# EAGLE design cm3 (EAGLE 7.7.0)
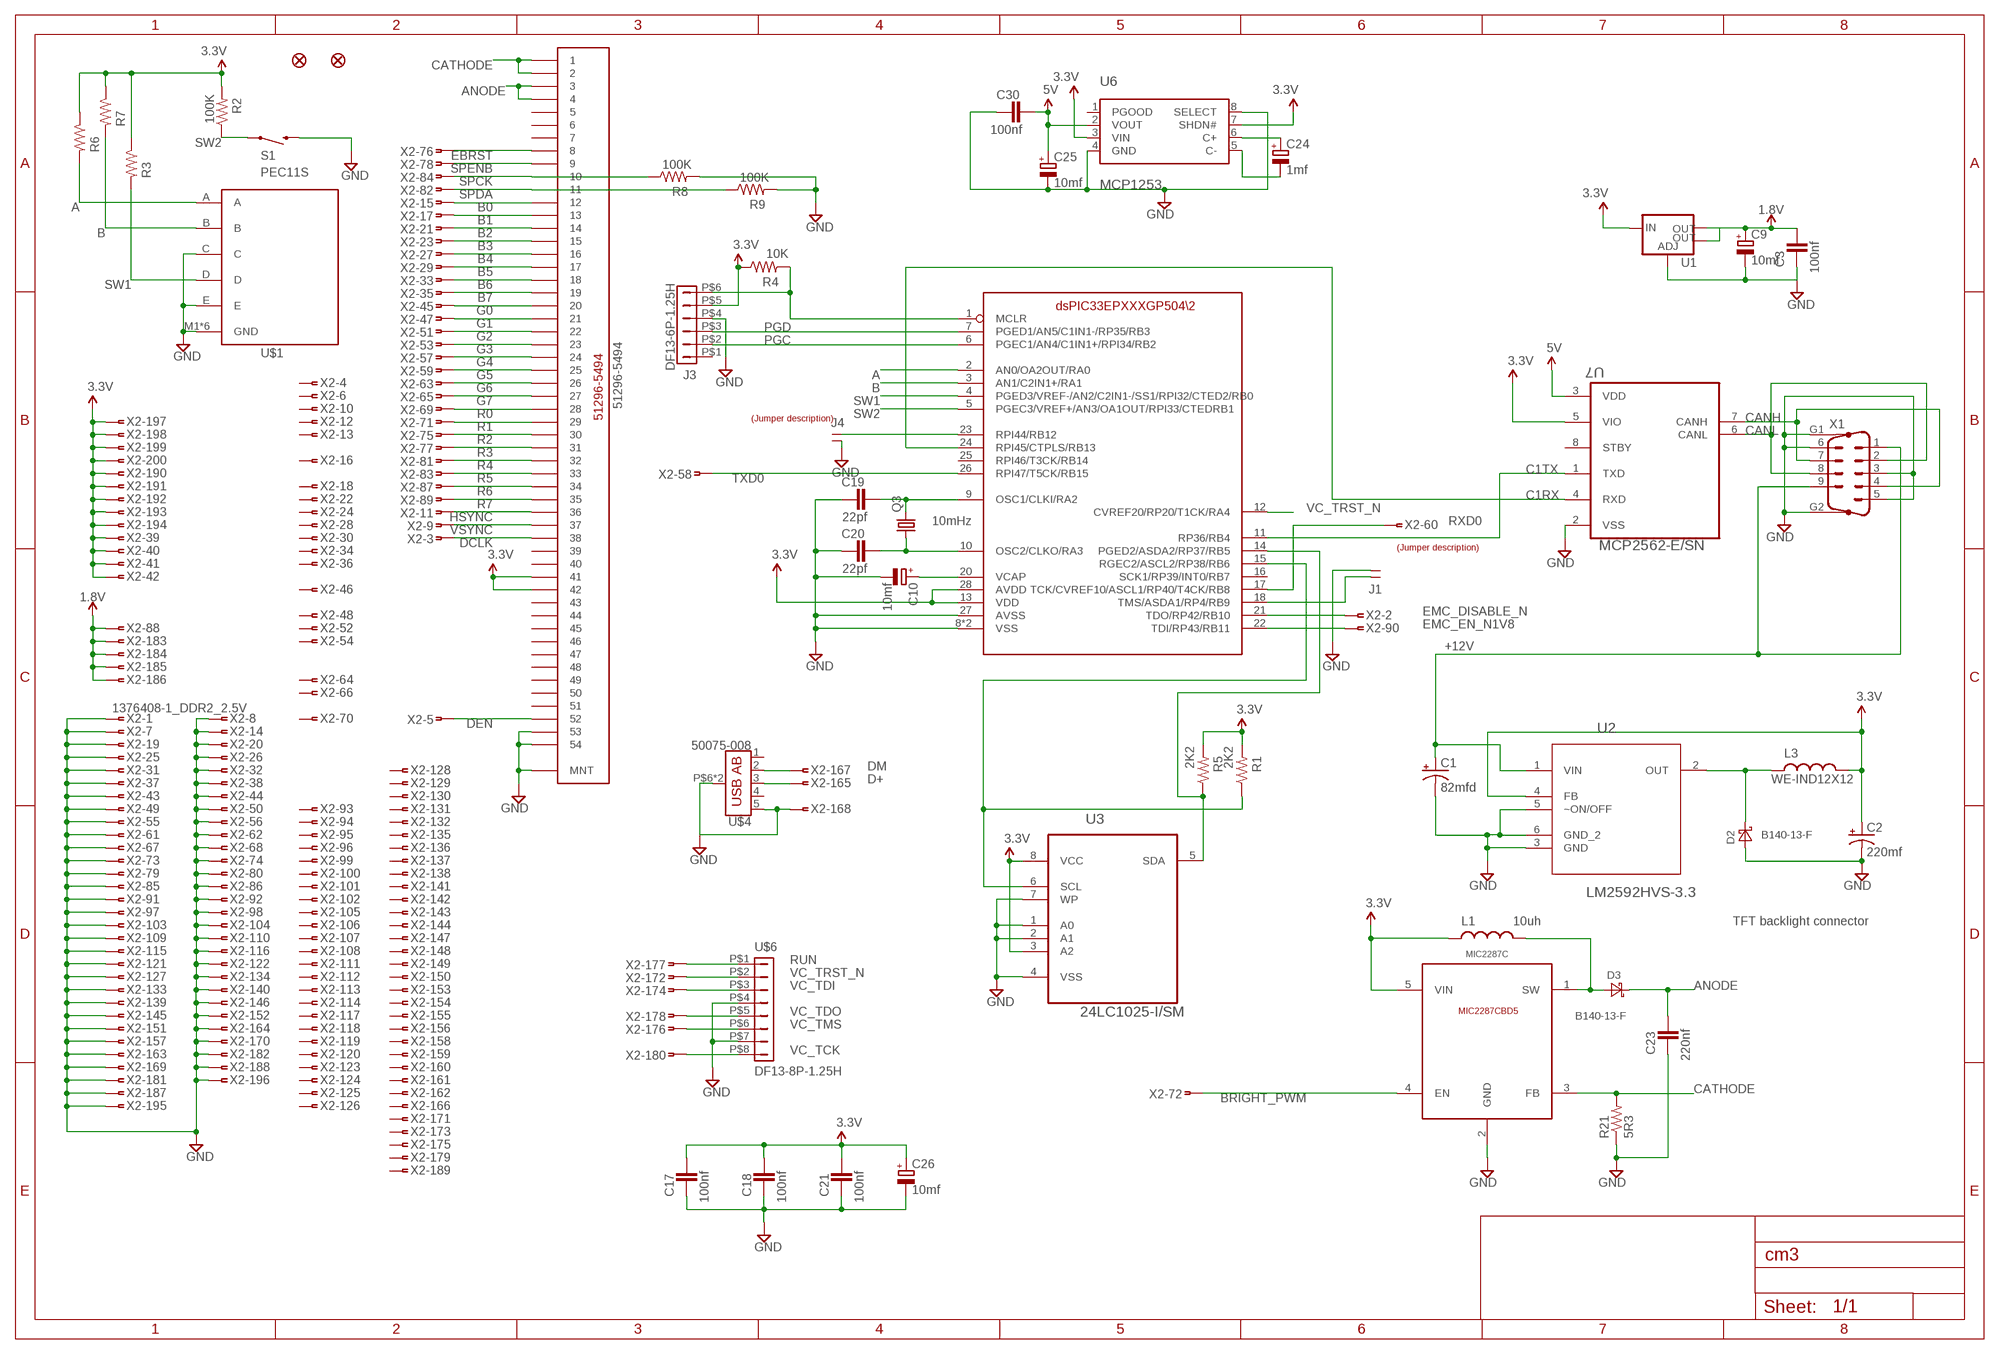
[diagram p0: schematic, sheet 1]

## Parts
C1  82mfd  CAPACITOR_POL-SVPF-E7  [SVPF-E7]
C2  220mf  CAP_POL7343  [EIA7343]
C3  100nf  CAPACITOR_NPOL-0805  [C805]
C9  10mf  CAPACITOR_POL-SMC_A  [SMC_A]
C10  10mf  CAPACITOR_POL-SMC_A  [SMC_A]
C17  100nf  CAPACITOR_NPOL-0805  [C805]
C18  100nf  CAPACITOR_NPOL-0805  [C805]
C19  22pf  CAPACITOR_NPOL-0805  [C805]
C20  22pf  CAPACITOR_NPOL-0805  [C805]
C21  100nf  CAPACITOR_NPOL-0805  [C805]
C23  220nf  CAPACITOR_NPOL-0805  [C805]
C24  1mf  CAPACITOR_POL-SMC_A  [SMC_A]
C25  10mf  CAPACITOR_POL-SMC_A  [SMC_A]
C26  10mf  CAPACITOR_POL-SMC_A  [SMC_A]
C30  100nf  CAPACITOR_NPOL-0805  [C805]
D2  B140-13-F  DIODE-SCHOTTKY-SMA  [SMA]
D3  B140-13-F  DIODE-SCHOTTKY-SMA  [SMA]
J1  JUMPER-1X2  [JUMPER-1X2]
J3  DF13-6P-1.25H  [DF13A-6P-1.25H]
J4  JUMPER-1X2  [JUMPER-1X2]
JP1  FIDUCIAL1.5X3  [FIDUCIAL-1.5X3]
JP2  FIDUCIAL1.5X3  [FIDUCIAL-1.5X3]
L1  10uh  INDUCTOR  [1812]
L3  WE-IND12X12  [IND12X12]
Q3  10mHz  CRYSTALHC49S  [HC49/S]
R1  2K2  RESISTOR0603-RES  [0603-RES]
R2  100K  RESISTOR0603-RES  [0603-RES]
R3  10K  RESISTOR0603-RES  [0603-RES]
R4  10K  RESISTOR0603-RES  [0603-RES]
R5  2K2  RESISTOR0603-RES  [0603-RES]
R6  10K  RESISTOR0603-RES  [0603-RES]
R7  10K  RESISTOR0603-RES  [0603-RES]
R8  100K  RESISTOR0603-RES  [0603-RES]
R9  100K  RESISTOR0603-RES  [0603-RES]
R21  5R3  RESISTOR1812-RES  [1812]
S1  SWITCH-MOMENTARY-2SMD-4  [TACTILE_SWITCH_TALL]
U1  V_REG_LM1117SOT223  [SOT223]
U2  LM2592HVS-3.3  LM2592HVS-5.0  [TO170P1435X457-5N]
U3  24LC1025-I/SM  [SOIC8-N_MC]
U5  DSPIC33EPXXXGP502  [SOIC-28]
U6  MCP1253  [MSOP8]
U7  MCP2562-E/SN  [SOIC-8N]
U9  MIC2287C  [SOT-23-5]
U$1  PEC11S  [PEC11S]
U$2  51296-5494  [51296-5494]
U$3  LABEL_JUMPER_1X2  [JUMP2_DESC]
U$4  50075-008  [500075-008]
U$5  LABEL_JUMPER_1X2  [JUMP2_DESC]
U$6  DF13-8P-1.25H  [DF13A-8P-1.25H]
X1  M09VP  [M09VP]
X2  1376408-1_DDR2_2.5V  [6-1376408-1]

## Nets
1.8V: C3.1 C9.+ U1.2(OUT) U1.4(OUT) X2.88 X2.183 X2.184 X2.185 X2.186
3.3V: C2.A(+) C17.1 C18.1 C21.1 C26.+ J3.P$5 L1.1 L3.P$2 R1.2 R2.2 R3.1 R4.1 R5.2 R6.1 R7.1 U1.3(IN) U2.4(FB) U3.3(A2) U3.8(VCC) U5.13(VDD) U5.28(AVDD) U6.3(VIN) U6.7(SHDN#) U7.5(VIO) U9.5(VIN) U$2.P$41 U$2.P$42 X2.39 X2.40 X2.41 X2.42 X2.190 X2.191 X2.192 X2.193 X2.194 X2.197 X2.198 X2.199 X2.200
5V: C25.+ C30.1 U6.2(VOUT) U7.3(VDD)
!MCLR: J3.P$6 R4.2 U5.1(MCLR)
+12V: C1.P$2(+) U2.1(VIN) X1.1 X1.9
A: R6.2 U5.2(AN0/OA2OUT/RA0) U$1.A
ANODE: C23.1 D3.C U$2.P$3 U$2.P$4
B: R7.2 U5.3(AN1/C2IN1+/RA1) U$1.B
B0: U$2.P$12 X2.15
B1: U$2.P$13 X2.17
B2: U$2.P$14 X2.21
B3: U$2.P$15 X2.23
B4: U$2.P$16 X2.27
B5: U$2.P$17 X2.29
B6: U$2.P$18 X2.33
B7: U$2.P$19 X2.35
BRIGHT_PWM: U9.4(EN) X2.72
C1RX: U5.24(RPI45/CTPLS/RB13) U7.4(RXD)
C1TX: U5.11(RP36/RB4) U7.1(TXD)
CANH: U7.7(CANH) X1.4 X1.7
CANL: U7.6(CANL) X1.2 X1.8
CATHODE: R21.2 U9.3(FB) U$2.P$1 U$2.P$2
D+: U$4.3(D+) X2.165
DCLK: U$2.P$38 X2.3
DEN: U$2.P$52 X2.5
DM: U$4.2(D-) X2.167
EBRST: U$2.P$8 X2.76
EMC_DISABLE_N: U5.21(TDO/RP42/RB10) X2.2
EMC_EN_N1V8: U5.22(TDI/RP43/RB11) X2.90
G0: U$2.P$20 X2.45
G1: U$2.P$21 X2.47
G2: U$2.P$22 X2.51
G3: U$2.P$23 X2.53
G4: U$2.P$24 X2.57
G5: U$2.P$25 X2.59
G6: U$2.P$26 X2.63
G7: U$2.P$27 X2.65
GND: C1.P$1(-) C2.C(-) C3.2 C9.- C10.- C17.2 C18.2 C19.2 C20.2 C21.2 C23.2 C25.- C26.- C30.2 D2.A J1.2 J3.P$4 J4.2 R8.2 R9.2 R21.1 S1.B2 U1.1(ADJ) U2.3(GND) U2.5(~ON/OFF) U2.6(GND_2) U3.1(A0) U3.2(A1) U3.4(VSS) U3.7(WP) U5.8(VSS) U5.19(VSS) U5.27(AVSS) U6.4(GND) U6.8(SELECT) U7.2(VSS) U9.2(GND) U$1.C U$1.E U$1.M1(GND) U$1.M2(GND) U$1.M3(GND) U$1.M4(GND) U$1.M5(GND) U$1.M6(GND) U$2.MNT1(MNT) U$2.MNT2(MNT) U$2.P$53 U$2.P$54 U$4.5(GND) U$4.P$6(SHIELD) U$4.P$7(SHIELD) U$6.P$4 U$6.P$7 X1.3 X1.5 X1.6 X1.G1 X1.G2 X2.1 X2.7 X2.8 X2.14 X2.19 X2.20 X2.25 X2.26 X2.31 X2.32 X2.37 X2.38 X2.43 X2.44 X2.49 X2.50 X2.55 X2.56 X2.61 X2.62 X2.67 X2.68 X2.73 X2.74 X2.79 X2.80 X2.85 X2.86 X2.91 X2.92 X2.97 X2.98 X2.103 X2.104 X2.109 X2.110 X2.115 X2.116 X2.121 X2.122 X2.127 X2.133 X2.134 X2.139 X2.140 X2.145 X2.146 X2.151 X2.152 X2.157 X2.163 X2.164 X2.168 X2.169 X2.170 X2.181 X2.182 X2.187 X2.188 X2.195 X2.196
HSYNC: U$2.P$36 X2.11
N$1: J1.1 U5.18(TMS/ASDA1/RP4/RB9)
N$12: D2.C L3.P$1 U2.2(OUT)
N$19: C19.1 Q3.2 U5.9(OSC1/CLKI/RA2)
N$25: C10.+ U5.20(VCAP)
N$37: C24.- U6.5(C-)
N$38: C24.+ U6.6(C+)
N$39: D3.A L1.2 U9.1(SW)
N$70: C20.1 Q3.1 U5.10(OSC2/CLKO/RA3)
PGC: J3.P$2 U5.6(PGEC1/AN4/C1IN1+/RPI34/RB2)
PGD: J3.P$3 U5.7(PGED1/AN5/C1IN1-/RP35/RB3)
R0: U$2.P$28 X2.69
R1: U$2.P$29 X2.71
R2: U$2.P$30 X2.75
R3: U$2.P$31 X2.77
R4: U$2.P$32 X2.81
R5: U$2.P$33 X2.83
R6: U$2.P$34 X2.87
R7: U$2.P$35 X2.89
RESET#: J4.1 U5.23(RPI44/RB12)
RUN: U$6.P$1 X2.177
RXD0: U5.17(TCK/CVREF10/ASCL1/RP40/T4CK/RB8) X2.60
SCL: R1.1 U3.6(SCL) U5.15(RGEC2/ASCL2/RP38/RB6)
SDA: R5.1 U3.5(SDA) U5.14(PGED2/ASDA2/RP37/RB5)
SPCK: R8.1 U$2.P$10 X2.84
SPDA: R9.1 U$2.P$11 X2.82
SPENB: U$2.P$9 X2.78
SW1: R3.2 U5.4(PGED3/VREF-/AN2/C2IN1-/SS1/RPI32/CTED2/RB0) U$1.D
SW2: R2.1 S1.A2 U5.5(PGEC3/VREF+/AN3/OA1OUT/RPI33/CTEDRB1)
TXD0: U5.26(RPI47/T5CK/RB15) X2.58
VC_TCK: U$6.P$8 X2.180
VC_TDI: U$6.P$3 X2.174
VC_TDO: U$6.P$5 X2.178
VC_TMS: U$6.P$6 X2.176
VC_TRST_N: U5.12(CVREF20/RP20/T1CK/RA4) U$6.P$2 X2.172
VSYNC: U$2.P$37 X2.9
Unconnected: J3.P$1 U5.16(SCK1/RP39/INT0/RB7) U5.25(RPI46/T3CK/RB14) U6.1(PGOOD) U7.8(STBY) U$2.P$5 U$2.P$6 U$2.P$7 U$2.P$39 U$2.P$40 U$2.P$43 U$2.P$44 U$2.P$45 U$2.P$46 U$2.P$47 U$2.P$48 U$2.P$49 U$2.P$50 U$2.P$51 U$4.4(USBID) X2.4 X2.6 X2.10 X2.12 X2.13 X2.16 X2.18 X2.22 X2.24 X2.28 X2.30 X2.34 X2.36 X2.46 X2.48 X2.52 X2.54 X2.64 X2.66 X2.70 X2.93 X2.94 X2.95 X2.96 X2.99 X2.100 X2.101 X2.102 X2.105 X2.106 X2.107 X2.108 X2.111 X2.112 X2.113 X2.114 X2.117 X2.118 X2.119 X2.120 X2.123 X2.124 X2.125 X2.126 X2.128 X2.129 X2.130 X2.131 X2.132 X2.135 X2.136 X2.137 X2.138 X2.141 X2.142 X2.143 X2.144 X2.147 X2.148 X2.149 X2.150 X2.153 X2.154 X2.155 X2.156 X2.158 X2.159 X2.160 X2.161 X2.162 X2.166 X2.171 X2.173 X2.175 X2.179 X2.189

## Notes on the sheet
- TFT backlight connector

## Power pins joined to a net without a drawn wire
VBUS: U$4.1(VBUS)

## Library data of the parts
C1 = kotuku:CAPACITOR_POL: Polarized capacitor in various packages
C2 = SparkFun:CAP_POL: Capacitor Polarized These are standard SMD and PTH capacitors. Normally 10uF, 47uF, and 100uF in electrolytic and tantalum varieties. Always verify the external diameter of the through hole cap, it varies with capacity, voltage, and manufacturer. The EIA devices should be standard.; PARTNO: T545X227M016ATE035
C3 C17 C18 C21 C30 = dp_devices:CAPACITOR_NPOL: Non-Polarized capacitor in various packages; PARTNO: CL21F104ZBCNNNC
C9 C10 C25 C26 = dp_devices:CAPACITOR_POL: Polarized capacitor in various packages; PARTNO: T491A106K004AT
C19 C20 = dp_devices:CAPACITOR_NPOL: Non-Polarized capacitor in various packages; PARTNO: C0805C220J5GACTU
C23 = dp_devices:CAPACITOR_NPOL: Non-Polarized capacitor in various packages; PARTNO: CL21F224ZBCNNNC
C24 = dp_devices:CAPACITOR_POL: Polarized capacitor in various packages; PARTNO: F931C105MAA
D2 D3 = diode2:DIODE-SCHOTTKY-: SCHOTTKY DIODE; PARTNO: B140-13-F
J1 J4 = QuantumOptics:JUMPER-1X2: Jumper, header, SIP on 0.1" grid, for option selection.; PARTNO: M20-9770246
J3 = con-hirose-df13:DF13-6P-1.25: DF13-6P 1.25mm Pitch Miniature Crimping Connector.; PARTNO: DF13A-6P-1.25H(20)
JP1 JP2 = SparkFun:FIDUCIAL: Fiducial Alignment Points Various fiducial points for machine vision alignment.
L1 = SparkFun:INDUCTOR: Inductors Basic Inductor/Choke - 0603 and 1206. Footprints are not proven and vary greatly between part numbers.; PARTNO: VLF504015MT-100M
L3 = kotuku:WE-IND12X12
Q3 = crystal:CRYSTAL: CRYSTAL; OC_FARNELL: 1667008; OC_NEWARK: unknown; PARTNO: ATS100B-E
R1 R5 = SparkFun-Passives:RESISTOR: Resistor; PARTNO: RC0603FR-072K2L
R2 R8 R9 = SparkFun-Passives:RESISTOR: Resistor; PARTNO: RC0603JR-07100KL
R3 R4 R6 R7 = SparkFun-Passives:RESISTOR: Resistor; PARTNO: RC0603FR-0710KL
R21 = SparkFun:RESISTOR: Resistor; PARTNO: RL1218FK-070R604L
S1 = SparkFun-Electromechanical:SWITCH-MOMENTARY-2: Various NO switches- pushbuttons, reed, etc; PARTNO: MJTP1138BTR; PROD_ID: SWCH-11966
U1 = SparkFun-IC-Power:V_REG_LM1117: Voltage Regulator LM1117 Standard adjustable voltage regulator but in SMD form. Spark Fun Electronics SKU : COM-00595; PROD_ID: VREG-08170
U2 = kotuku:LM2592HVS-5.0: SIMPLE SWITCHER; MPN: LM2592HVS-5.0; OC_FARNELL: -; OC_NEWARK: 41K3791; PACKAGE: TO-263-5; SUPPLIER: National Semiconductor
U3 = Microchip_By_element14_Batch_1:24LC1025-I/SM: 1024K I2C CMOS Serial EEPROM; PARTNO: 24LC1025T-I/SN
U5 = kotuku:DSPIC33EPXXXGP502
U6 = microchip-dspic:MCP1253: Positive-Regulated Charge Pump (3.3x5.0); PARTNO: MCP1253-33X50I/MS
U7 = Microchip-MCP2562-E_SN:MCP2562-E/SN: High-Speed CAN Transceiver,SOIC-8; PARTNO: MCP2562-E/SN
U9 = Microchip_By_element14_Batch_1:MIC2287C; PARTNO: MIC2287CYD5-TR
U$1 = VAWQ3-Q24-S5H:PEC11S; PARTNO: PEC11S-9215K-H0015
U$2 = VAWQ3-Q24-S5H:51296-5494; PARTNO: 51296-5494
U$3 = dp_devices:LABEL_JUMPER_1X2: Nice formatted two legged jumperdescription Use attributes to change the values ON = With jumper OFF = Without jumper; OFF: Normal; ON: Reset
U$4 = kotuku:50075-008
U$5 = dp_devices:LABEL_JUMPER_1X2: Nice formatted two legged jumperdescription Use attributes to change the values ON = With jumper OFF = Without jumper; OFF: EMC Boot; ON: USB Boot
U$6 = con-hirose-df13:DF13-8P-1.25: DF13-8P 1.25mm Pitch Miniature Crimping Connector.
X1 = con-subd:M09VP: SUB-D; OC_FARNELL: unknown; OC_NEWARK: unknown
X2 = con-amp:1376408: DDR1 & DDR2 SODIMM SOCKET 0.6mm Pitch 200 Pos. Standard Profile, Standard Type (used on Kontron X-Board) Source: http://catalog.tycoelectronics.com .. JPN_CD_1376408_S.pdf

## Net classes
2 12v: width 0.152 mm, drill 0.305 mm, clearance 0.305 mm

## Board
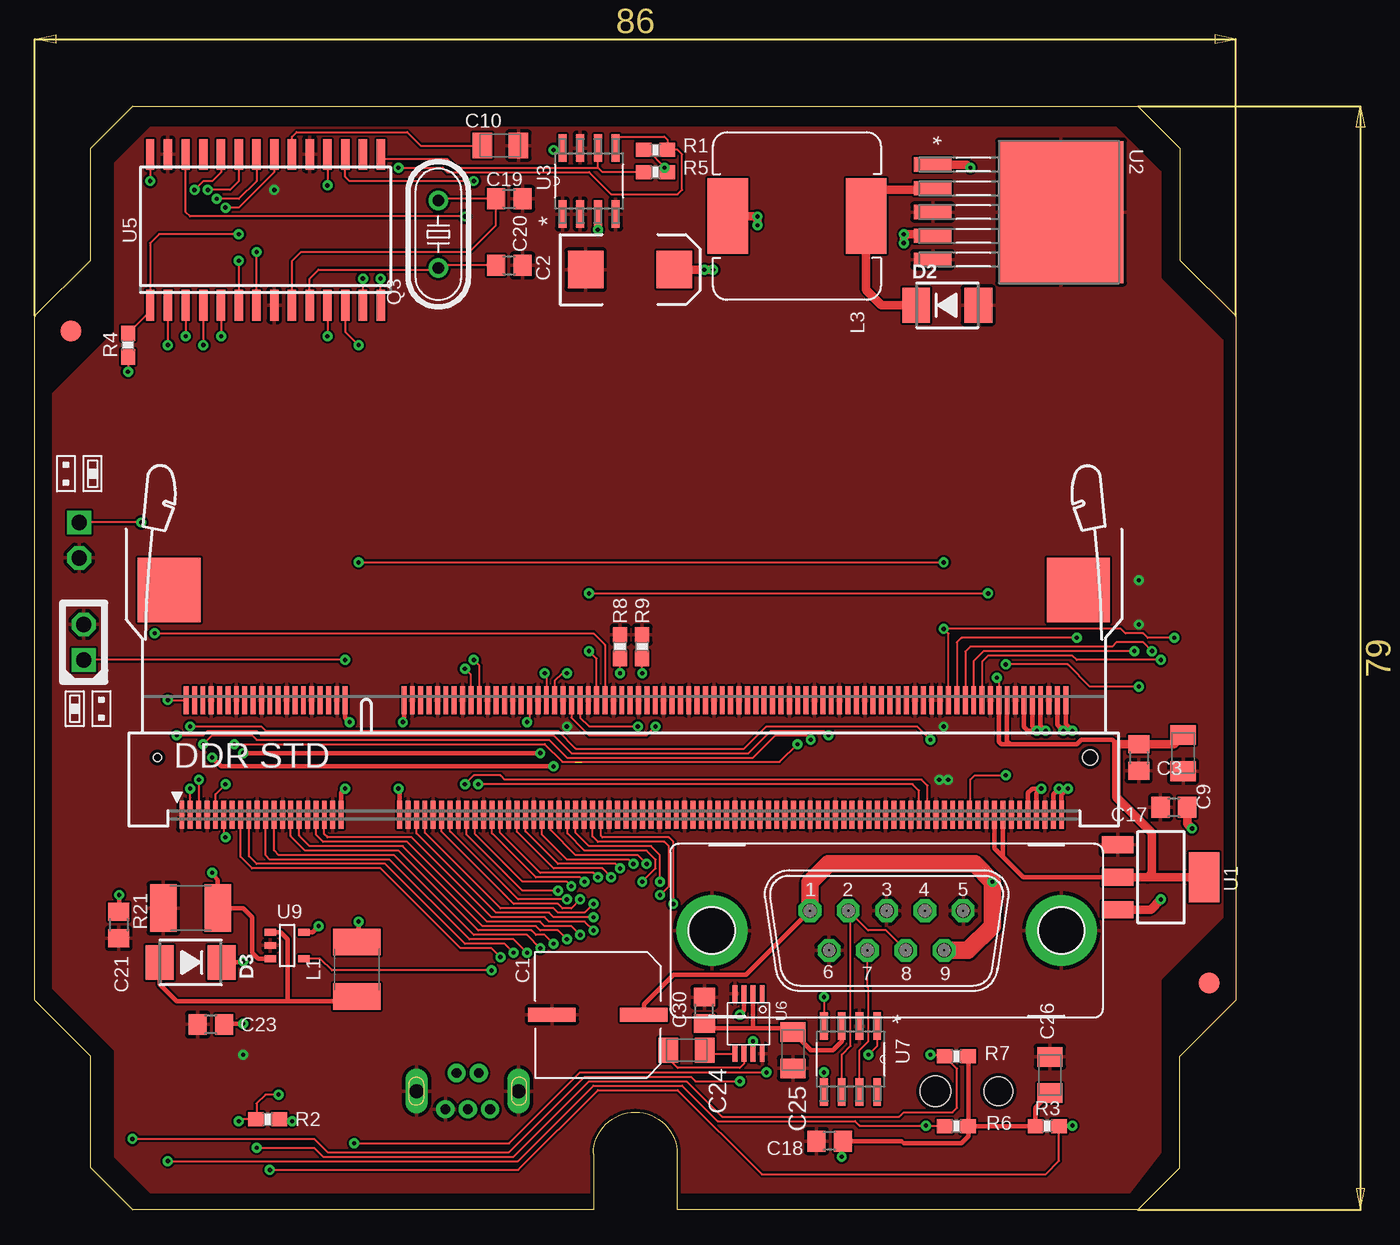
[diagram p1: board, top side]
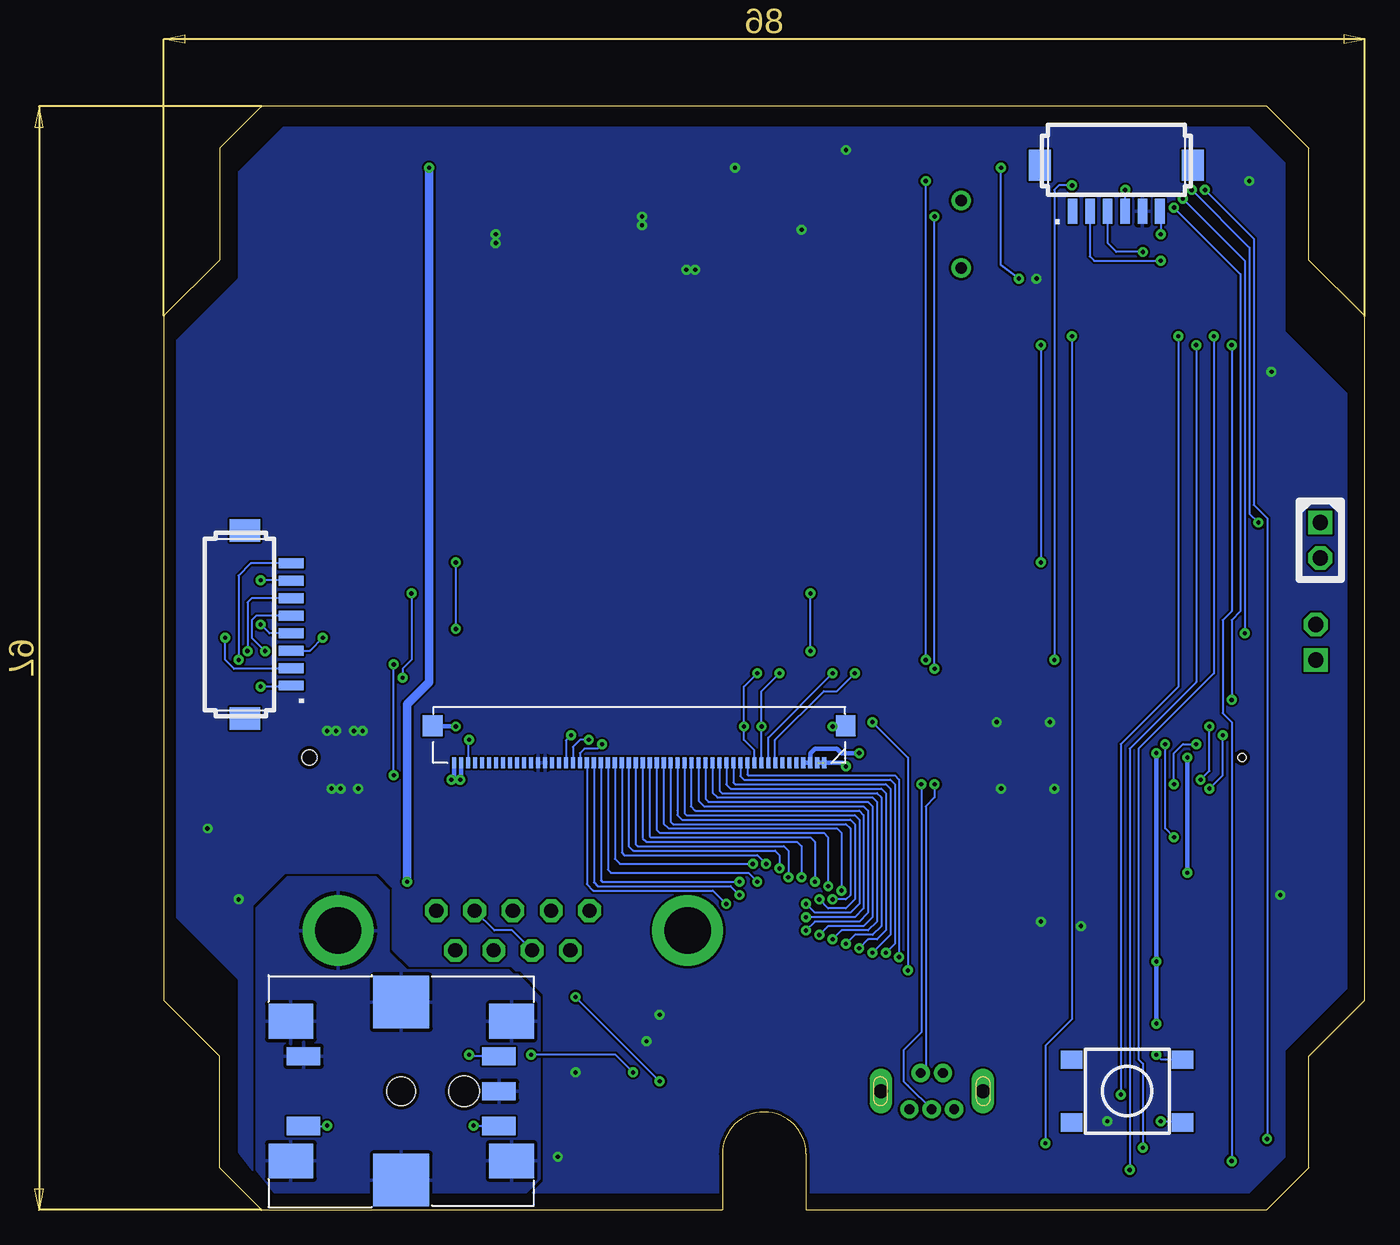
[diagram p2: board, bottom side, seen from below]

Size 86 x 79 mm. Coordinates in mm from the lower left corner, seen from the top.
Outline: 0,15 0,64 4,68 4,76 7,79 79,79 82,76 82,68 86,64 86,15 82,11 82,3 79,0 46,0 46,4 arc180 40,4 40,0 7,0 4,3 4,11 0,15
Copper layers (1*16): Top 0.035mm / dielectric 1.5mm / Bottom 0.035mm
Design rules "DesignRules": minimum track width 6mil, minimum drill 12mil, track to track 6mil, track to pad 6mil, pad to pad 6mil, via to via 6mil, smd to smd 0mil, copper to edge 10mil, drill to drill 10mil, minimum pad ring 12mil, minimum via ring 8mil, stop-mask expansion 2mil, vias tented up to drill 25mil, thermal gap 10mil

### Footprints (pad centres in the part's own frame; a part is rotated, then mirrored left to right if it is on the bottom)
SVPF-E7 = smd 1 x 3.4: P$1 0,3.3; P$2 0,-3.3
EIA7343 = smd 2.55 x 2.7: A 3.17,0; C -3.17,0
C805 = smd 1.3 x 1.5: 1 -0.95,0; 2 0.95,0
SMC_A = smd 1.4 x 1.8: + -1.3,0; - 1.3,0
SMA = smd 2 x 2.5: A 2.223,0; C -2.223,0
JUMPER-1X2 = drill 1.092 square: 1 0,2.54 | drill 1.092 octagon: 2 0,0
DF13A-6P-1.25H = smd 1.6 x 2.2: M$0 -5.475,2.4; M$1 5.475,2.4 | smd 0.7 x 1.8: P$1 -3.125,-0.9; P$2 -1.875,-0.9; P$3 -0.625,-0.9; P$4 0.625,-0.9; P$5 1.875,-0.9; P$6 3.125,-0.9
FIDUCIAL-1.5X3 = smd 1.5 x 1.5: 1 0,0
1812 = smd 1.9 x 3.4: 1 -1.95,0; 2 1.95,0
IND12X12 = smd 5.4 x 2.9: P$1 6,10.95; P$2 6,1.05
HC49/S = drill 0.813: 1 -2.413,0; 2 2.413,0
0603-RES = smd 1.1 x 1: 1 -0.85,0; 2 0.85,0
TACTILE_SWITCH_TALL = smd 1.55 x 1.3: A1 -3.975,-2.25; A2 3.975,-2.25; B1 -3.975,2.25; B2 3.975,2.25
SOT223 = smd 1.219 x 2.235: 1 -2.311,-3.099; 2 0,-3.099; 3 2.311,-3.099 | smd 3.6 x 2.2: 4 0,3.099
TO170P1435X457-5N = smd 1.016 x 2.692: 1 -3.404,-9.042; 2 -1.702,-9.042; 3 0,-9.042; 4 1.702,-9.042; 5 3.404,-9.042 | smd 10.16 x 8.941: 6 0,0.152
SOIC8-N_MC = smd 1.981 x 0.559: 1 -2.362,1.905; 2 -2.362,0.635; 3 -2.362,-0.635; 4 -2.362,-1.905; 5 2.362,-1.905; 6 2.362,-0.635; 7 2.362,0.635; 8 2.362,1.905
SOIC-28 = smd 0.6 x 2.2: 1 -8.255,-5.4; 2 -6.985,-5.4; 3 -5.715,-5.4; 4 -4.445,-5.4; 5 -3.175,-5.4; 6 -1.905,-5.4; 7 -0.635,-5.4; 8 0.635,-5.4; 9 1.905,-5.4; 10 3.175,-5.4; 11 4.445,-5.4; 12 5.715,-5.4; 13 6.985,-5.4; 14 8.255,-5.4; 15 8.255,5.4; 16 6.985,5.4; 17 5.715,5.4; 18 4.445,5.4; 19 3.175,5.4; 20 1.905,5.4; 21 0.635,5.4; 22 -0.635,5.4; 23 -1.905,5.4; 24 -3.175,5.4; 25 -4.445,5.4; 26 -5.715,5.4; 27 -6.985,5.4; 28 -8.255,5.4
MSOP8 = smd 1.2 x 0.35: 1 -2.145,0.975; 2 -2.145,0.325; 3 -2.145,-0.325; 4 -2.145,-0.975; 5 2.145,-0.975; 6 2.145,-0.325; 7 2.145,0.325; 8 2.145,0.975
SOIC-8N = smd 1.981 x 0.559: 1 1.448,5.715; 2 1.448,4.445; 3 1.448,3.175; 4 1.448,1.905; 5 6.172,1.905; 6 6.172,3.175; 7 6.172,4.445; 8 6.172,5.715
SOT-23-5 = smd 0.8 x 0.5: 1 -1.2,0.95; 2 -1.2,0; 3 -1.2,-0.95; 4 1.2,-0.95; 5 1.2,0.95
PEC11S = smd 1.3 x 2.4: A -2.5,-7; B 2.5,-7; C 0,-7; D -2.5,7; E 2.5,7 | smd 2.5 x 3.2: M1 -5,7.9; M2 5,7.9; M5 -5,-7.9; M6 5,-7.9 | smd 3.75 x 4: M3 6.375,0; M4 -6.375,0 | hole 2.05: 0,0 | hole 2.2: 0,-4.5
51296-5494 = smd 1.4 x 1.5: MNT1 -1.55,-2.65; MNT2 28.05,-2.65 | smd 0.3 x 0.8: P$1 0,0; P$2 0.5,0; P$3 1,0; P$4 1.5,0; P$5 2,0; P$6 2.5,0; P$7 3,0; P$8 3.5,0; P$9 4,0; P$10 4.5,0; P$11 5,0; P$12 5.5,0; P$13 6,0; P$14 6.5,0; P$15 7,0; P$16 7.5,0; P$17 8,0; P$18 8.5,0; P$19 9,0; P$20 9.5,0; P$21 10,0; P$22 10.5,0; P$23 11,0; P$24 11.5,0; P$25 12,0; P$26 12.5,0; P$27 13,0; P$28 13.5,0; P$29 14,0; P$30 14.5,0; P$31 15,0; P$32 15.5,0; P$33 16,0; P$34 16.5,0; P$35 17,0; P$36 17.5,0; P$37 18,0; P$38 18.5,0; P$39 19,0; P$40 19.5,0; P$41 20,0; P$42 20.5,0; P$43 21,0; P$44 21.5,0; P$45 22,0; P$46 22.5,0; P$47 23,0; P$48 23.5,0; P$49 24,0; P$50 24.5,0; P$51 25,0; P$52 25.5,0; P$53 26,0; P$54 26.5,0
500075-008 = drill 0.7: 1 -1.6,-1.3; 2 -0.8,1.3; 3 0,-1.3; 4 0.8,1.3; 5 1.6,-1.3 | drill 1 long: P$6 -3.65,0; P$7 3.65,0
DF13A-8P-1.25H = smd 1.6 x 2.2: M$0 -6.725,2.4; M$1 6.725,2.4 | smd 0.7 x 1.8: P$1 -4.375,-0.9; P$2 -3.125,-0.9; P$3 -1.875,-0.9; P$4 -0.625,-0.9; P$5 0.625,-0.9; P$6 1.875,-0.9; P$7 3.125,-0.9; P$8 4.375,-0.9
M09VP = drill 1.016 octagon: 1 -5.486,1.422; 2 -2.743,1.422; 3 0,1.422; 4 2.743,1.422; 5 5.486,1.422; 6 -4.115,-1.422; 7 -1.372,-1.422; 8 1.372,-1.422; 9 4.115,-1.422 | drill 3.302 pad 5.08: G1 -12.522,0; G2 12.522,0
6-1376408-1 = smd 0.35 x 2: 1 -32.65,-4.1; 2 -32.35,4.1; 3 -32.05,-4.1; 4 -31.75,4.1; 5 -31.45,-4.1; 6 -31.15,4.1; 7 -30.85,-4.1; 8 -30.55,4.1; 9 -30.25,-4.1; 10 -29.95,4.1; 11 -29.65,-4.1; 12 -29.35,4.1; 13 -29.05,-4.1; 14 -28.75,4.1; 15 -28.45,-4.1; 16 -28.15,4.1; 17 -27.85,-4.1; 18 -27.55,4.1; 19 -27.25,-4.1; 20 -26.95,4.1; 21 -26.65,-4.1; 22 -26.35,4.1; 23 -26.05,-4.1; 24 -25.75,4.1; 25 -25.45,-4.1; 26 -25.15,4.1; 27 -24.85,-4.1; 28 -24.55,4.1; 29 -24.25,-4.1; 30 -23.95,4.1; 31 -23.65,-4.1; 32 -23.35,4.1; 33 -23.05,-4.1; 34 -22.75,4.1; 35 -22.45,-4.1; 36 -22.15,4.1; 37 -21.85,-4.1; 38 -21.55,4.1; 39 -21.25,-4.1; 40 -20.95,4.1; 41 -17.05,-4.1; 42 -16.75,4.1; 43 -16.45,-4.1; 44 -16.15,4.1; 45 -15.85,-4.1; 46 -15.55,4.1; 47 -15.25,-4.1; 48 -14.95,4.1; 49 -14.65,-4.1; 50 -14.35,4.1; 51 -14.05,-4.1; 52 -13.75,4.1; 53 -13.45,-4.1; 54 -13.15,4.1; 55 -12.85,-4.1; 56 -12.55,4.1; 57 -12.25,-4.1; 58 -11.95,4.1; 59 -11.65,-4.1; 60 -11.35,4.1; 61 -11.05,-4.1; 62 -10.75,4.1; 63 -10.45,-4.1; 64 -10.15,4.1; 65 -9.85,-4.1; 66 -9.55,4.1; 67 -9.25,-4.1; 68 -8.95,4.1; 69 -8.65,-4.1; 70 -8.35,4.1; 71 -8.05,-4.1; 72 -7.75,4.1; 73 -7.45,-4.1; 74 -7.15,4.1; 75 -6.85,-4.1; 76 -6.55,4.1; 77 -6.25,-4.1; 78 -5.95,4.1; 79 -5.65,-4.1; 80 -5.35,4.1; 81 -5.05,-4.1; 82 -4.75,4.1; 83 -4.45,-4.1; 84 -4.15,4.1; 85 -3.85,-4.1; 86 -3.55,4.1; 87 -3.25,-4.1; 88 -2.95,4.1; 89 -2.65,-4.1; 90 -2.35,4.1; 91 -2.05,-4.1; 92 -1.75,4.1; 93 -1.45,-4.1; 94 -1.15,4.1; 95 -0.85,-4.1; 96 -0.55,4.1; 97 -0.25,-4.1; 98 0.05,4.1; 99 0.35,-4.1; 100 0.65,4.1; 101 0.95,-4.1; 102 1.25,4.1; 103 1.55,-4.1; 104 1.85,4.1; 105 2.15,-4.1; 106 2.45,4.1; 107 2.75,-4.1; 108 3.05,4.1; 109 3.35,-4.1; 110 3.65,4.1; 111 3.95,-4.1; 112 4.25,4.1; 113 4.55,-4.1; 114 4.85,4.1; 115 5.15,-4.1; 116 5.45,4.1; 117 5.75,-4.1; 118 6.05,4.1; 119 6.35,-4.1; 120 6.65,4.1; 121 6.95,-4.1; 122 7.25,4.1; 123 7.55,-4.1; 124 7.85,4.1; 125 8.15,-4.1; 126 8.45,4.1; 127 8.75,-4.1; 128 9.05,4.1; 129 9.35,-4.1; 130 9.65,4.1; 131 9.95,-4.1; 132 10.25,4.1; 133 10.55,-4.1; 134 10.85,4.1; 135 11.15,-4.1; 136 11.45,4.1; 137 11.75,-4.1; 138 12.05,4.1; 139 12.35,-4.1; 140 12.65,4.1; 141 12.95,-4.1; 142 13.25,4.1; 143 13.55,-4.1; 144 13.85,4.1; 145 14.15,-4.1; 146 14.45,4.1; 147 14.75,-4.1; 148 15.05,4.1; 149 15.35,-4.1; 150 15.65,4.1; 151 15.95,-4.1; 152 16.25,4.1; 153 16.55,-4.1; 154 16.85,4.1; 155 17.15,-4.1; 156 17.45,4.1; 157 17.75,-4.1; 158 18.05,4.1; 159 18.35,-4.1; 160 18.65,4.1; 161 18.95,-4.1; 162 19.25,4.1; 163 19.55,-4.1; 164 19.85,4.1; 165 20.15,-4.1; 166 20.45,4.1; 167 20.75,-4.1; 168 21.05,4.1; 169 21.35,-4.1; 170 21.65,4.1; 171 21.95,-4.1; 172 22.25,4.1; 173 22.55,-4.1; 174 22.85,4.1; 175 23.15,-4.1; 176 23.45,4.1; 177 23.75,-4.1; 178 24.05,4.1; 179 24.35,-4.1; 180 24.65,4.1; 181 24.95,-4.1; 182 25.25,4.1; 183 25.55,-4.1; 184 25.85,4.1; 185 26.15,-4.1; 186 26.45,4.1; 187 26.75,-4.1; 188 27.05,4.1; 189 27.35,-4.1; 190 27.65,4.1; 191 27.95,-4.1; 192 28.25,4.1; 193 28.55,-4.1; 194 28.85,4.1; 195 29.15,-4.1; 196 29.45,4.1; 197 29.75,-4.1; 198 30.05,4.1; 199 30.35,-4.1; 200 30.65,4.1 | smd 4.5 x 4.6: M1 -33.55,12; M2 31.55,12 | hole 0.6: -34.4,0 | hole 1.1: 32.4,0

### Placement (x,y rotation side)
C1  40.32,13.97 90 top
C2  42.62,67.31 0 top
C3  79.06,32.38 270 top
C9  82.23,32.7 270 top
C10  33.34,76.2 0 top
C17  81.57,28.82 180 top
C18  56.92,4.93 180 top
C19  33.97,72.39 0 top
C20  33.97,67.63 0 top
C21  6,20.4 270 top
C23  12.6,13.27 180 top
C24  46.67,11.43 0 top
C25  54.29,11.43 270 top
C26  72.69,9.65 90 top
C30  47.94,14.29 90 top
D2  65.34,64.77 0 top
D3  11.16,17.71 180 top
J1  3.49,41.91 180 top
J3  17.78,72.39 0 bottom
J4  3.17,46.67 0 bottom
JP1  2.59,62.91 0 top
JP2  84.09,16.24 0 top
L1  23.05,17.22 270 top
L3  48.58,77.15 270 top
Q3  28.89,69.85 90 top
R1  44.45,74.3 0 top
R2  16.67,6.49 0 top
R3  72.5,6 0 top
R4  6.67,61.91 90 top
R5  44.45,75.88 180 top
R6  66,6 180 top
R7  66,11 180 top
R8  41.91,40.32 90 top
R9  43.5,40.32 90 top
R21  11.15,21.61 0 top
S1  17,8.5 0 bottom
U1  80.64,23.81 270 top
U2  73.34,71.44 270 top
U3  39.69,73.66 90 top
U5  16.51,70.17 0 top
U6  51.12,13.34 270 top
U7  54.61,14.61 270 top
U9  18.06,18.93 0 top
U$1  69,8.5 90 bottom
U$2  38.7,32 180 bottom
U$3  3.49,55.24 90 top
U$4  31,8.5 0 bottom
U$5  3.49,33.34 270 top
U$6  77.79,41.91 90 bottom
X1  61,20 0 top
X2  43.18,32.38 0 top

### Tracks (layer width: path | path; a pad name or v marks a point on that pad's centre or on a via)
1.8V  (via drill 0.3)
  Top 0.152: X2.88 40.23,39.46 v39.69,40.01 | v39.69,44.13 v68.26,44.13 | v68.9,38.1 69.03,37.97 X2.184
  Top 0.305: X2.184 69.03,33.52 69.22,33.34 69.85,33.34 | 69.85,33.34 74.61,33.34 74.93,33.66 77.15,33.66 77.47,33.34 | X2.186 69.63,33.56 69.85,33.34 | X2.185 69.33,25.29 | 69.33,25.29 70.8,23.81 U1.2 | X2.183 68.73,25.89 69.33,25.29
  Top 0.61: U1.4 79.69,23.81 | 79.69,23.81 U1.2 | C9.+ 81.56,33.34 C3.1 77.47,33.34 77.47,29.53 80.01,26.99 80.01,24.13 79.69,23.81
  Bottom 0.152: v39.69,40.01 v39.69,44.13 | v68.26,44.13 68.26,39.37 68.9,38.73 v68.9,38.1
3.3V  (via drill 0.3)
  Top 0.152: U7.5 v56.52,9.84 | R4.1 v6.67,60.01 | U5.28 v8.26,73.66 | R5.2 43.92,75.88 v45.09,74.61 45.3,74.72 R1.2 | U5.13 v23.5,66.67 | R2.2 18.27,6.49 v18.41,6.35 | U3.8 37.64,75.88 v37.15,75.88 | U3.3 v40.32,70.17
  Top 0.305: L1.1 23.18,19.3 v23.18,20.64 | C21.1 6.03,21.38 v6.03,22.54 | X2.41 26.13,30.07 v26.04,30.16 | X2.42 26.43,35 v26.35,34.92 | X2.40 22.23,35.24 v22.54,34.92 | X2.39 21.93,29.87 v22.23,30.16 | U9.5 19.88,19.88 v20.32,20.32 | R6.1 R3.1 71.65,7.32 C26.+ | R6.1 R7.1 | R6.1 66.85,5.25 66.36,4.76 62.23,4.76 62.06,4.93 C18.1 57.78,5.48 v57.78,3.81 57.69,4.34 | U6.7 51.44,11.74 v51.44,12.06 | U6.3 50.79,14.28 v50.48,13.97 | X2.199 73.53,29.71 v73.98,30.16 | X2.197 72.93,29.75 v73.34,30.16 | X2.193 71.73,29.82 v72.07,30.16 71.44,30.16 71.13,29.86 X2.191 | X2.190 70.83,34.58 71.12,34.29 v71.75,34.29 71.43,34.62 X2.192 | X2.194 72.03,34.65 v72.39,34.29 | X2.198 73.23,34.72 v73.66,34.29 | X2.200 73.83,34.76 v74.3,34.29
  Top 0.61: U1.3 79.92,21.5 v80.64,22.23 | C17.1 82.52,27.65 v82.87,27.3 | U2.4 64.19,69.85 v62.23,69.85 v62.23,69.22 | L3.P$2 49.66,71.12 v51.75,71.12 v51.75,70.48 | C2.A v47.94,67.31 v48.58,67.31
  pour Bottom (rank 2): 1.27,58.42 5.71,62.87 5.71,74.93 8.26,77.47 77.47,77.47 80.64,74.3 80.64,66.67 85.09,62.23 85.09,20.95 80.64,16.51 80.64,4.13 78.42,1.27 8.26,1.27 5.71,3.81 5.71,11.43 1.27,15.88
5V
  Top 0.305: U7.3 57.78,12.06 57.15,11.43 55.56,11.43 55.56,11.46 C25.+ 54.26,13.02 52.39,13.02 51.44,13.01 | U6.2 51.44,13.01 | C30.1 48.26,13.02 51.13,13.02 51.44,13.01
!MCLR  (via drill 0.3)
  Top 0.152: v14.61,69.85 8.89,69.85 8.26,69.22 U5.1 8.26,64.35 R4.2
  Bottom 0.152: J3.P$6 14.61,71.44 v14.61,69.85
+12V  (via drill 0.3)
  Top 0.305: C1.P$2 43.62,14.73 45.72,16.83 50.92,16.83 X1.1
  Top 0.61: U2.1 66.76,74.84 v66.99,74.61
  Top 1.27: X1.1 55.51,23.45 56.83,24.77 67.31,24.77 v68.58,23.5 68.58,20.32 66.84,18.58 X1.9
  Bottom 0.61: v66.99,74.61 66.99,37.78 68.58,36.2 v68.58,23.5
A  (via drill 0.3)
  Top 0.152: R6.2 65.12,6.03 v63.82,6.03 59.05,6.03 58.74,6.35 48.9,6.35 46.35,8.89 40.01,8.89 34.61,3.49 v9.53,3.49 | U5.2 v9.53,61.91
  Bottom 0.152: U$1.A 63.78,6 v63.82,6.03 | v9.53,61.91 9.53,42.86 10.16,42.23 10.16,35.56 9.53,34.92 v9.53,3.49
ANODE  (via drill 0.3)
  Top 0.305: v36.2,32.7 v14.92,32.7 | v14.92,17.78 14.54,17.71 D3.C | C23.1 13.62,13.34 v14.92,13.34
  Bottom 0.305: U$2.P$4 U$2.P$3 39.69,32.01 39.69,32.7 39.37,33.02 37.78,33.02 37.47,32.7 v36.2,32.7 | v14.92,32.7 v14.92,17.78 v14.92,13.34
B  (via drill 0.3)
  Top 0.152: v64.14,11.11 65.04,11.11 R7.2 66.04,10.11 66.04,7.3 65.72,6.99 62.23,6.99 61.91,6.67 49.21,6.67 46.67,9.21 39.69,9.21 34.29,3.81 20.64,3.81 20,4.45 v15.88,4.45 | U5.3 v10.79,62.55
  Bottom 0.152: U$1.B 64.02,11 v64.14,11.11 | v10.79,62.55 10.79,38.42 16.19,33.02 16.19,10.79 15.88,10.48 v15.88,4.45
B0  (via drill 0.3)
  Top 0.152: v33.34,18.1 32.7,18.73 30.48,18.73 24.77,24.45 15.56,24.45 14.73,25.27 X2.15
  Bottom 0.152: U$2.P$12 44.2,31.18 44.13,31.11 33.66,31.11 33.34,30.8 v33.34,18.1
B1  (via drill 0.3)
  Top 0.152: v34.29,18.41 33.66,19.05 30.8,19.05 25.08,24.77 15.88,24.77 15.33,25.31 X2.17
  Bottom 0.152: U$2.P$13 44.7,31.05 44.45,30.8 33.97,30.8 33.66,30.48 33.66,19.05 v34.29,18.41
B2  (via drill 0.3)
  Top 0.152: v35.24,18.41 34.29,19.37 31.11,19.37 25.4,25.08 16.83,25.08 16.53,25.38 X2.21
  Bottom 0.152: U$2.P$14 45.2,30.59 45.09,30.48 34.29,30.48 33.97,30.16 33.97,19.68 v35.24,18.41
B3  (via drill 0.3)
  Top 0.152: v36.2,18.73 35.24,19.68 31.43,19.68 25.72,25.4 17.46,25.4 17.13,25.73 X2.23
  Bottom 0.152: U$2.P$15 45.7,30.5 45.72,30.48 45.4,30.16 34.61,30.16 34.29,29.84 34.29,20 34.92,19.37 35.56,19.37 v36.2,18.73
B4  (via drill 0.3)
  Top 0.152: v37.15,19.05 36.51,19.68 35.88,19.68 35.56,20 31.75,20 26.04,25.72 19.37,25.72 18.33,26.75 X2.27
  Bottom 0.152: U$2.P$16 46.2,30.01 46.04,29.84 34.92,29.84 34.61,29.53 34.61,20.32 35.24,19.68 36.51,19.68 v37.15,19.05
B5  (via drill 0.3)
  Top 0.152: v38.1,19.37 37.47,20 36.2,20 35.88,20.32 32.07,20.32 26.35,26.04 19.68,26.04 18.93,26.79 X2.29
  Bottom 0.152: U$2.P$17 46.7,29.87 46.35,29.53 35.24,29.53 34.92,29.21 34.92,20.64 35.56,20 37.47,20 v38.1,19.37
B6  (via drill 0.3)
  Top 0.152: v39.05,19.68 38.42,20.32 36.51,20.32 36.2,20.64 32.38,20.64 26.67,26.35 20.64,26.35 20.13,26.86 X2.33
  Bottom 0.152: U$2.P$18 47.2,29.42 46.99,29.21 35.56,29.21 35.24,28.89 35.24,20.95 35.88,20.32 38.42,20.32 v39.05,19.68
B7  (via drill 0.3)
  Top 0.152: v40.01,20 39.37,20.64 36.83,20.64 36.51,20.95 32.7,20.95 26.99,26.67 20.95,26.67 20.73,26.89 X2.35
  Bottom 0.152: U$2.P$19 47.7,29.29 47.31,28.89 35.88,28.89 35.56,28.57 35.56,21.27 36.2,20.64 39.37,20.64 v40.01,20
BRIGHT_PWM  (via drill 0.3)
  Top 0.152: X2.72 35.43,35.11 v35.24,34.92 | v32.7,17.14 21.27,17.14 20.44,17.98 U9.4
  Bottom 0.152: v35.24,34.92 32.7,32.38 v32.7,17.14
C1RX  (via drill 0.3)
  Top 0.152: U5.24 13.34,74.3 12.7,73.66 12.06,73.66 v11.43,73.03 | v6.99,5.08 20,5.08 20.95,4.13 33.97,4.13 39.37,9.53 46.99,9.53 47.31,9.21 v50.48,9.21 | v56.52,15.24 U7.4
  Bottom 0.152: v11.43,73.03 7.94,69.53 7.94,50.48 6.99,49.53 v6.99,5.08 | v50.48,9.21 v56.52,15.24
C1TX  (via drill 0.3)
  Top 0.152: U5.11 v20.95,62.55 | v22.86,4.76 33.97,4.76 39.05,9.84 v52.39,9.84 | v59.69,11.11 60.33,11.75 U7.1
  Bottom 0.152: v20.95,62.55 20.95,13.65 22.86,11.75 v22.86,4.76 | v52.39,9.84 53.66,11.11 v59.69,11.11
CANH
  Top 0.152: U7.7 59.05,11.43 59.69,12.06 59.69,15.88 59.63,15.94 X1.7
  Bottom 0.152: X1.7 61.05,20 62.32,20 X1.4
CANL
  Top 0.152: X1.8 62.37,18.59 60.96,20 59.68,20 X1.2 58.42,21.26 58.42,11.75 57.78,11.11 U7.6
CATHODE  (via drill 0.3)  (1 unrouted)
  Top 0.305: v12.7,24.13 13.11,23.58 R21.2 13.12,21.59 14.92,21.59 15.56,20.95 15.56,18.41 15.99,17.98 U9.3 | v12.7,32.38 13.34,31.75 v37.15,31.75
  Bottom 0.305: v12.7,24.13 v12.7,32.38 | v37.15,31.75 37.4,32 U$2.P$2
D+  (via drill 0.3)
  Top 0.152: X2.165 63.33,30.02 62.87,30.48 v31.75,30.48
  Bottom 0.152: v31.75,30.48 31.75,12.7 33.02,11.43 33.02,9.21 32.69,8.89 U$4.3
DCLK  (via drill 0.3)
  Top 0.152: X2.3 11.13,29.51 v11.11,30.16 | v10.16,33.97 12.06,33.97 12.38,34.29 15.88,34.29 16.19,33.97 37.15,33.97 38.42,32.7 51.12,32.7 52.7,34.29 56.52,34.29 v56.83,33.97
  Bottom 0.152: v11.11,30.16 10.16,31.11 v10.16,33.97 | v56.83,33.97 57.2,33.6 U$2.P$38
DEN  (via drill 0.3)
  Top 0.152: X2.5 11.75,28.3 v11.75,30.8 | v11.11,34.61 16.19,34.61 16.51,34.29 37.47,34.29 38.73,33.02 50.8,33.02 52.39,34.61 63.18,34.61 v64.14,33.66
  Bottom 0.152: v11.75,30.8 11.11,31.43 v11.11,34.61 | v64.14,33.66 64.2,33.59 U$2.P$52
DM  (via drill 0.3)
  Top 0.152: X2.167 63.93,30.37 63.5,30.8 33.66,30.8 33.34,31.11 31.43,31.11 v30.8,30.48
  Bottom 0.152: v30.8,30.48 30.8,29.53 31.43,28.89 31.43,10.17 U$4.2
EBRST  (via drill 0.3)
  Top 0.152: v36.51,38.42 36.63,38.3 X2.76
  Bottom 0.152: U$2.P$8 42.23,32.03 42.23,33.66 38.73,37.15 37.78,37.15 v36.51,38.42
EMC_DISABLE_N  (via drill 0.3)
  Top 0.152: U5.21 17.14,74.3 14.61,71.75 v13.65,71.75 | v9.53,36.51 9.55,36.48 X2.2
  Bottom 0.152: v13.65,71.75 8.89,66.99 8.89,42.86 9.53,42.23 v9.53,36.51
EMC_EN_N1V8  (via drill 0.3)
  Top 0.152: U5.22 15.88,73.66 14.61,72.39 v13.02,72.39 | v8.57,41.27 40.01,41.27 40.83,40.45 X2.90
  Bottom 0.152: v13.02,72.39 8.57,67.94 v8.57,41.27
G0  (via drill 0.3)
  Top 0.152: v40.01,20.95 37.15,20.95 36.83,21.27 33.02,21.27 27.33,26.96 X2.45
  Bottom 0.152: U$2.P$20 48.26,31.94 48.26,28.89 47.94,28.57 36.2,28.57 35.88,28.26 35.88,21.59 36.51,20.95 v40.01,20.95
G1  (via drill 0.3)
  Top 0.152: v40.01,21.91 39.37,21.27 37.47,21.27 37.15,21.59 33.34,21.59 27.93,27 X2.47
  Bottom 0.152: U$2.P$21 48.7,28.38 48.58,28.26 36.51,28.26 36.2,27.94 36.2,21.91 36.83,21.27 39.37,21.27 v40.01,21.91
G2  (via drill 0.3)
  Top 0.152: v39.05,22.23 38.42,21.59 37.78,21.59 37.47,21.91 34.29,21.91 29.13,27.07 X2.51
  Bottom 0.152: U$2.P$22 49.2,28.59 49.21,28.57 49.21,28.26 48.9,27.94 36.83,27.94 36.51,27.62 36.51,22.23 37.15,21.59 38.42,21.59 v39.05,22.23
G3  (via drill 0.3)
  Top 0.152: v38.1,22.23 34.61,22.23 29.73,27.1 X2.53
  Bottom 0.152: U$2.P$23 49.7,27.79 49.53,27.62 37.15,27.62 36.83,27.3 36.83,22.54 37.15,22.23 v38.1,22.23
G4  (via drill 0.3)
  Top 0.152: v37.47,22.86 34.92,22.86 30.93,26.86 X2.57
  Bottom 0.152: U$2.P$24 50.2,27.66 49.85,27.3 37.78,27.3 37.47,26.99 v37.47,22.86
G5  (via drill 0.3)
  Top 0.152: v38.42,23.18 38.1,23.5 34.92,23.5 31.53,26.89 X2.59
  Bottom 0.152: U$2.P$25 50.7,27.2 50.48,26.99 38.73,26.99 38.42,26.67 v38.42,23.18
G6  (via drill 0.3)
  Top 0.152: v39.37,23.5 39.05,23.81 35.88,23.81 32.73,26.96 X2.63
  Bottom 0.152: U$2.P$26 51.2,26.75 51.12,26.67 39.69,26.67 39.37,26.35 v39.37,23.5
G7  (via drill 0.3)
  Top 0.152: v40.32,23.81 40.01,24.13 36.2,24.13 33.33,27 X2.65
  Bottom 0.152: U$2.P$27 51.7,26.62 51.44,26.35 40.64,26.35 40.32,26.04 v40.32,23.81
GND  (via drill 0.3)
  Bottom 0.152: S1.B2 14.56,10.75 v14.92,11.11 | U$6.P$7 76.94,45.09 v79.06,45.09 | U$6.P$4 78.42,41.27 v79.06,41.91 | J3.P$4 17.14,71.5 v17.14,73.03
  Bottom 0.305: U$2.MNT1 37.19,34.61 v38.1,34.61 | U$2.MNT2 66.71,34.61 v65.09,34.61 | U$2.P$54 65.2,31 v65.41,30.8 | U$2.P$53 64.7,30.87 v64.77,30.8
  pour Top (rank 2): 1.27,58.42 1.27,15.88 5.71,11.43 5.71,3.81 8.26,1.27 78.42,1.27 80.64,4.13 80.64,16.51 85.09,20.95 85.09,62.23 80.64,66.67 80.64,74.3 77.47,77.47 8.26,77.47 5.71,74.93 5.71,62.87
  pour Bottom: 69.85,22.86 70.8,23.81 77.15,23.81 79.38,21.59 79.38,2.86 78.11,1.27 60.01,1.27 59.05,2.22 59.05,15.24 60.64,16.83 60.96,16.83 61.28,17.14 68.58,17.14 69.85,18.41
HSYNC  (via drill 0.3)
  Top 0.152: X2.11 13.53,26.79 v13.65,26.67 | v14.29,33.34 36.51,33.34 37.78,32.07 53.34,32.07 v54.61,33.34
  Bottom 0.152: v13.65,26.67 14.29,27.3 v14.29,33.34 | v54.61,33.34 54.93,33.02 55.88,33.02 56.2,32.7 U$2.P$36
N$1  (via drill 0.3)
  Top 0.152: U5.18 v20.95,73.34 | v22.23,39.37 J1.1
  Bottom 0.152: v20.95,73.34 21.91,73.34 22.23,73.03 v22.23,39.37
N$12
  Top 0.61: U2.2 64.19,73.03 59.69,73.03 59.53,72.86 L3.P$1 59.53,65.89 60.64,64.77 D2.C
N$19
  Top 0.152: Q3.2 29.02,72.39 C19.1 33.02,70.48 31.11,68.58 19.05,68.58 18.41,67.94 U5.9
N$25
  Top 0.152: U5.20 18.41,76.83 18.73,77.15 26.67,77.15 27.62,76.2 C10.+
N$37
  Top 0.152: C24.- 48.21,11.19 U6.5
N$38
  Top 0.152: U6.6 50.8,10.48 50.48,10.16 46.04,10.16 45.37,10.82 C24.+
N$39
  Top 0.305: D3.A 8.94,16.15 10.16,14.92 18.1,14.92 | 18.1,14.92 22.54,14.92 23.18,15.56 22.23,15.46 L1.2 | U9.1 17.59,19.88 18.1,19.37 18.1,14.92
N$70
  Top 0.152: C20.1 29.08,67.63 Q3.1 28.77,67.31 20.32,67.31 19.68,66.67 U5.10
PGC  (via drill 0.3)
  Top 0.152: v14.61,67.94 U5.6
  Bottom 0.152: J3.P$2 19.68,71.46 19.68,68.26 19.37,67.94 v14.61,67.94
PGD  (via drill 0.3)
  Top 0.152: U5.7 v15.88,68.58
  Bottom 0.152: v15.88,68.58 17.78,68.58 18.41,69.2 J3.P$3
R0  (via drill 0.3)
  Top 0.152: v41.27,23.81 40.64,24.45 37.15,24.45 34.53,27.07 X2.69
  Bottom 0.152: U$2.P$28 52.2,26.16 52.07,26.04 41.59,26.04 41.27,25.72 v41.27,23.81
R1  (via drill 0.3)
  Top 0.152: v41.91,24.45 41.59,24.77 37.47,24.77 35.13,27.1 X2.71
  Bottom 0.152: v41.91,24.45 41.91,25.4 42.23,25.72 52.39,25.72 52.7,26.03 U$2.P$29
R2  (via drill 0.3)
  Top 0.152: v42.86,24.77 42.55,25.08 38.1,25.08 36.33,26.85 X2.75
  Bottom 0.152: U$2.P$30 53.2,25.58 53.02,25.4 43.5,25.4 v42.86,24.77
R3  (via drill 0.3)
  Top 0.152: v43.81,24.77 43.18,25.4 38.73,25.4 36.93,27.2 X2.77
  Bottom 0.152: U$2.P$31 53.7,25.12 53.34,24.77 v43.81,24.77
R4  (via drill 0.3)
  Top 0.152: v43.5,23.5 44.45,24.45 44.45,25.08 43.81,25.72 39.37,25.72 38.13,26.96 X2.81
  Bottom 0.152: U$2.P$32 54.2,24.36 53.98,24.13 44.13,24.13 v43.5,23.5
R5  (via drill 0.3)
  Top 0.152: v44.77,23.5 44.77,25.4 44.13,26.04 39.69,26.04 38.73,26.99 X2.83
  Bottom 0.152: U$2.P$33 54.7,23.59 54.61,23.5 v44.77,23.5
R6  (via drill 0.3)
  Top 0.152: v44.77,22.54 45.4,23.18 45.4,26.04 45.09,26.35 40.32,26.35 39.93,26.75 X2.87
  Bottom 0.152: U$2.P$34 55.2,23.45 54.93,23.18 45.4,23.18 v44.77,22.54
R7  (via drill 0.3)
  Top 0.152: v45.72,21.91 45.72,26.35 45.4,26.67 40.64,26.67 40.53,26.78 X2.89
  Bottom 0.152: U$2.P$35 55.7,23.32 55.24,22.86 46.67,22.86 v45.72,21.91
RESET#  (via drill 0.3)
  Top 0.152: U5.23 14.61,73.66 13.97,73.03 v12.38,73.03 | v7.62,49.21 J4.1
  Bottom 0.152: v12.38,73.03 8.26,68.9 8.26,49.85 v7.62,49.21
RUN  (via drill 0.3)
  Top 0.152: v79.06,37.47 75.56,37.47 73.98,39.05 v69.53,39.05 | X2.177 66.99,28.35 66.99,30.8 67.31,31.11 v69.53,31.11
  Bottom 0.152: U$6.P$1 76.96,37.47 v79.06,37.47 | v69.53,31.11 v69.53,39.05
RXD0  (via drill 0.3)
  Top 0.152: X2.60 31.83,38.97 v31.43,39.37 | v31.43,73.66 22.54,73.66 22.23,73.98 U5.17
  Bottom 0.152: v31.43,39.37 v31.43,73.66
SCL
  Top 0.152: R1.1 40.64,74.3 40.32,74.61 | 40.32,74.61 U3.6 | U5.15 25.09,75.25 29.53,75.25 30.16,74.61 40.32,74.61
SDA  (via drill 0.3)
  Top 0.152: U5.14 v24.77,66.67 | v26.04,74.61 29.21,74.61 29.53,74.3 39.69,74.3 41.27,72.71 46.04,72.71 46.35,73.03 46.35,75.56 46.04,75.88 R5.1 45.3,76.62 45.09,76.83 41.59,76.83 41.73,75.88 U3.5
  Bottom 0.152: v24.77,66.67 26.04,67.63 v26.04,74.61
SPCK  (via drill 0.3)
  Top 0.152: v41.91,38.42 R8.1 | X2.84 39.05,36.46 39.05,35.24 39.69,34.61 v43.18,34.61 43.2,34.61
  Bottom 0.152: U$2.P$10 43.2,34.61 | 43.2,34.61 43.2,37.13 v41.91,38.42 | v43.18,34.61 43.2,34.61
SPDA  (via drill 0.3)
  Top 0.152: v43.5,38.42 R9.1 | X2.82 38.42,36.47 38.42,35.24 39.69,33.97 43.81,33.97 v44.45,34.61
  Bottom 0.152: U$2.P$11 43.7,32.91 44.45,33.66 v44.45,34.61 44.45,37.47 v43.5,38.42
SPENB  (via drill 0.3)
  Top 0.152: v38.1,38.42 37.78,38.42 37.23,37.87 X2.78
  Bottom 0.152: U$2.P$9 42.7,33.82 v38.1,38.42
SW1  (via drill 0.3)
  Top 0.152: v74.3,6.03 73.38,6.03 R3.2 73.35,3.5 72.39,2.54 52.07,2.54 46.04,8.57 40.32,8.57 34.61,2.86 v16.83,2.86 | U5.4 v12.06,61.91
  Bottom 0.152: U$1.D 74.33,6 v74.3,6.03 | v12.06,61.91 12.06,37.78 16.83,33.02 v16.83,2.86
SW2  (via drill 0.3)
  Top 0.152: U5.5 v13.34,62.55 | v17.46,8.26 16.51,8.26 15.88,7.62 15.88,6.55 R2.1 14.75,6.49 v14.61,6.35
  Bottom 0.152: v13.34,62.55 13.34,37.47 17.46,33.34 v17.46,8.26 | v14.61,6.35 13.12,6.35 S1.A2
TXD0  (via drill 0.3)
  Top 0.152: X2.58 31.23,38.3 v30.8,38.73 | v30.8,71.12 11.11,71.12 10.79,71.44 U5.26
  Bottom 0.152: v30.8,38.73 v30.8,71.12
VC_TCK  (via drill 0.3)
  Top 0.152: v80.64,39.37 74.61,39.37 74.3,39.69 68.26,39.69 67.83,39.26 X2.180
  Bottom 0.152: U$6.P$8 79.76,46.28 80.64,45.4 v80.64,39.37
VC_TDI  (via drill 0.3)
  Top 0.152: v74.61,40.96 66.36,40.96 66.03,40.63 X2.174
  Bottom 0.152: U$6.P$3 75.53,40.03 v74.61,40.96
VC_TDO  (via drill 0.3)
  Top 0.152: v78.74,40.01 67.94,40.01 67.23,39.29 X2.178
  Bottom 0.152: U$6.P$5 76.9,42.55 79.38,42.55 79.69,42.23 79.69,40.96 v78.74,40.01
VC_TMS  (via drill 0.3)
  Top 0.152: v80.01,40.01 79.38,40.64 77.47,40.64 77.15,40.32 66.99,40.32 66.63,39.96 X2.176
  Bottom 0.152: U$6.P$6 79.72,43.78 80.01,43.5 v80.01,40.01
VC_TRST_N  (via drill 0.3)
  Top 0.152: v81.6,40.96 79.69,40.96 79.38,41.27 78.11,41.27 77.79,41.59 v65.09,41.59 65.43,41.25 X2.172 | U5.12 22.23,62.87 v23.18,61.91 | v23.18,46.35 v65.09,46.35
  Bottom 0.152: U$6.P$2 76.94,38.73 80.96,38.73 81.6,39.37 v81.6,40.96 | v23.18,61.91 v23.18,46.35 | v65.09,46.35 v65.09,41.59
VSYNC  (via drill 0.3)
  Top 0.152: X2.9 12.93,29.76 v13.65,30.48 | v12.06,33.34 12.7,33.97 15.56,33.97 15.88,33.66 36.83,33.66 38.1,32.38 51.44,32.38 53.02,33.97 55.24,33.97 v55.56,33.66
  Bottom 0.152: v13.65,30.48 13.65,32.7 13.02,33.34 v12.06,33.34 | v55.56,33.66 56.2,33.66 56.7,33.15 U$2.P$37